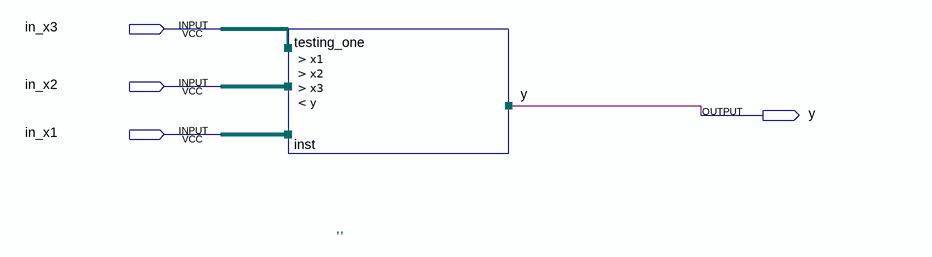
[diagram p0: schematic sheet]
// Quartus schematic Block1.bdf as structural Verilog: 1 symbols, 4 pins
module Block1 (
  input  in_x3,
  input  in_x2,
  input  in_x1,
  output y
);

  testing_one inst (.x1(in_x1), .x2(in_x2), .x3(in_x3), .y(y));

  // Notes on the sheet:
  //   ,,
endmodule
